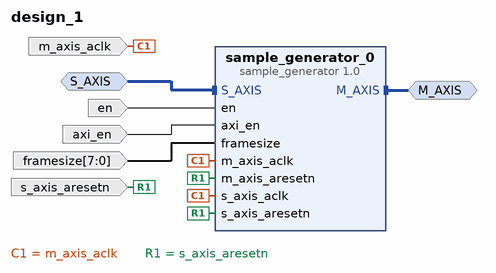
[diagram p0: block diagram of the top level]
# Vivado block design design_1, xc7z010clg400-1, Vivado 2018.3
create_bd_design design_1

create_bd_intf_port -mode Slave -vlnv xilinx.com:interface:axis_rtl:1.0 S_AXIS
set_property -dict [list \
  CONFIG.HAS_TKEEP 0 \
  CONFIG.HAS_TLAST 0 \
  CONFIG.HAS_TREADY 1 \
  CONFIG.HAS_TSTRB 0 \
  CONFIG.LAYERED_METADATA undef \
  CONFIG.TDATA_NUM_BYTES 4 \
  CONFIG.TDEST_WIDTH 0 \
  CONFIG.TID_WIDTH 0 \
  CONFIG.TUSER_WIDTH 0 \
] [get_bd_intf_ports S_AXIS]
create_bd_intf_port -mode Master -vlnv xilinx.com:interface:axis_rtl:1.0 M_AXIS
create_bd_port -dir I en
create_bd_port -dir I axi_en
create_bd_port -dir I -type clk m_axis_aclk
set_property -dict {CONFIG.FREQ_HZ 100000000} [get_bd_ports m_axis_aclk]
create_bd_port -dir I -type rst s_axis_aresetn
create_bd_port -dir I -from 7 -to 0 framesize

create_bd_cell -type ip -vlnv MT:user:sample_generator:1.0 sample_generator_0

# ---- connections ----

connect_bd_intf_net [get_bd_intf_ports S_AXIS] [get_bd_intf_pins sample_generator_0/S_AXIS]
connect_bd_intf_net [get_bd_intf_ports M_AXIS] [get_bd_intf_pins sample_generator_0/M_AXIS]
connect_bd_net [get_bd_ports en] [get_bd_pins sample_generator_0/en]
connect_bd_net [get_bd_ports axi_en] [get_bd_pins sample_generator_0/axi_en]
connect_bd_net [get_bd_ports m_axis_aclk] [get_bd_pins sample_generator_0/m_axis_aclk] [get_bd_pins sample_generator_0/s_axis_aclk]
connect_bd_net [get_bd_ports s_axis_aresetn] [get_bd_pins sample_generator_0/m_axis_aresetn] [get_bd_pins sample_generator_0/s_axis_aresetn]
connect_bd_net [get_bd_ports framesize] [get_bd_pins sample_generator_0/framesize]

validate_bd_design
save_bd_design
